# EAGLE design Batboard rev 2.2 (EAGLE 9.1.3)

## Sheet 1 of 7
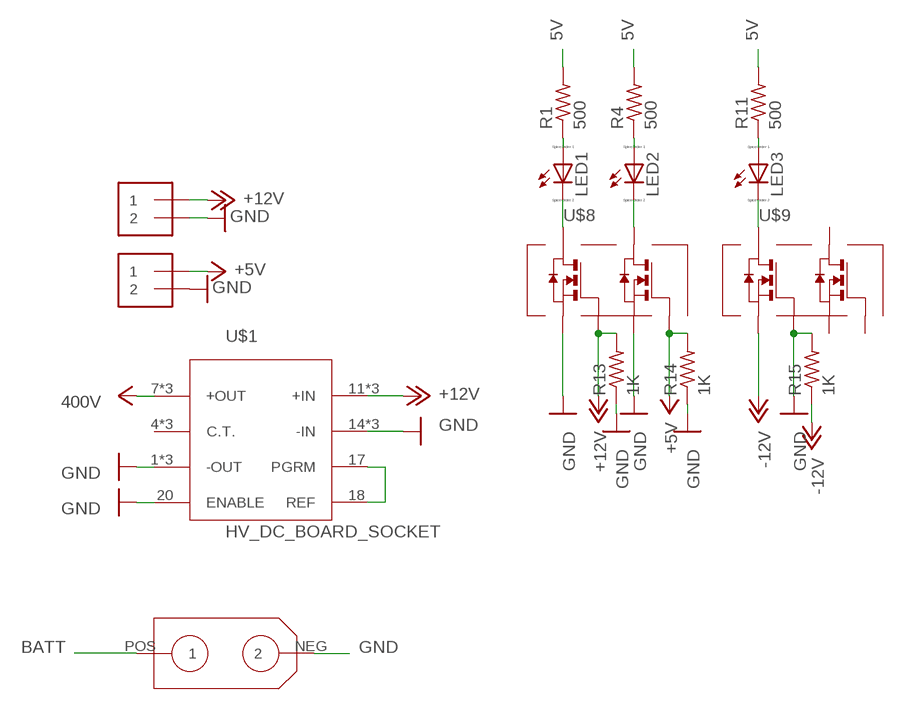
[diagram p0: schematic, sheet 1]

### Parts
J1  1X2-3.5MM  [1X2-3.5MM]
J6  1X2-3.5MM  [1X2-3.5MM]
LED1  LED_E  [LED_1206]
LED2  LED_E  [LED_1206]
LED3  LED_E  [LED_1206]
R1  500  R-US_R1206  [R1206]
R4  500  R-US_R1206  [R1206]
R11  500  R-US_R1206  [R1206]
R13  1K  R-US_R1206  [R1206]
R14  1K  R-US_R1206  [R1206]
R15  1K  R-US_R1206  [R1206]
U$1  HV_DC_BOARD_SOCKET  [HV-DC_BOARD_SOCKET]
U$6  XT60  [XT60]
U$8  DMN2004DMK_DUAL_N-CHANNEL_MOSFET_ARRAY  [SOT23-6]
U$9  DMN2004DMK_DUAL_N-CHANNEL_MOSFET_ARRAY  [SOT23-6]

### Nets
5V: R1.2 R4.2 R11.2
+5V: J6.1 R14.2 U$8.2(G1) ; also sheet 4
+12V: J1.1 R13.2 U$1.11(+IN) U$1.12(+IN) U$1.13(+IN) U$8.5(G) ; also sheet 2,3,5,7
-12V: R15.1 U$9.4(S) ; also sheet 2,5
BATT: U$6.POS ; also sheet 3,4
GND: J1.2 J6.2 R13.1 R14.1 R15.2 U$1.1(-OUT) U$1.2(-OUT) U$1.3(-OUT) U$1.14(-IN) U$1.15(-IN) U$1.16(-IN) U$1.20(ENABLE) U$6.NEG U$8.1(S1) U$8.4(S) U$9.5(G) ; also sheet 2,3,4,5,7
N$1: U$1.17(PGRM) U$1.18(REF)
N$31: LED1.A R1.1
N$84: LED2.A R4.1
N$85: LED3.A R11.1
N$86: LED3.C U$9.6(D)
N$87: LED1.C U$8.6(D)
N$88: LED2.C U$8.3(D1)
V+: U$1.7(+OUT) U$1.8(+OUT) U$1.9(+OUT) ; supply symbol labelled 400V ; also sheet 5
Unconnected: U$1.4(C.T.) U$1.5(C.T.) U$1.6(C.T.) U$9.1(S1) U$9.2(G1) U$9.3(D1)

## Sheet 2 of 7
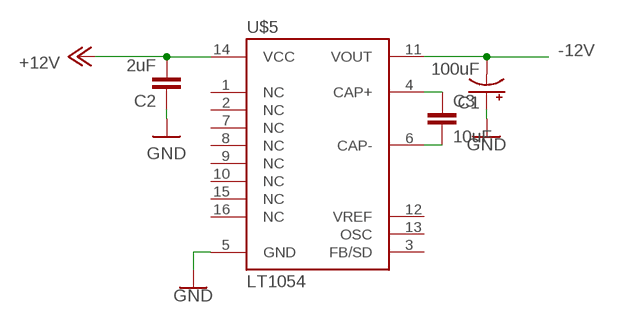
[diagram p1: schematic, sheet 2]

### Parts
C1  100uF  100UF-POLAR-25V-20%(ELEC)  [PANASONIC_D]
C2  2uF  1.0UF-1206-50V-10%  [1206]
C3  10uF  1.0UF-1206-50V-10%  [1206]
U$5  LT1054  [SO16L]

### Nets
+12V: C2.2 U$5.14(VCC) ; also sheet 1,3,5,7
-12V: C1.- U$5.11(VOUT) ; also sheet 1,5
GND: C1.+ C2.1 U$5.5(GND) ; also sheet 1,3,4,5,7
N$46: C3.1 U$5.4(CAP+)
N$47: C3.2 U$5.6(CAP-)
Unconnected: U$5.1(NC) U$5.2(NC) U$5.3(FB/SD) U$5.7(NC) U$5.8(NC) U$5.9(NC) U$5.10(NC) U$5.12(VREF) U$5.13(OSC) U$5.15(NC) U$5.16(NC)

## Sheet 3 of 7
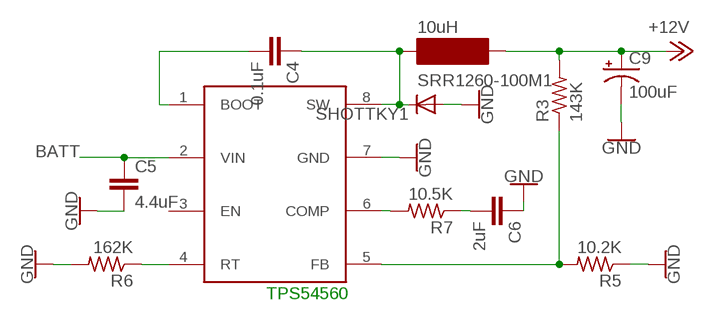
[diagram p2: schematic, sheet 3]

### Parts
C4  0.1uF  1.0UF-1206-50V-10%  [1206]
C5  4.4uF  1.0UF-1206-50V-10%  [1206]
C6  2uF  1.0UF-1206-50V-10%  [1206]
C9  100uF  100UF-POLAR-25V-20%(ELEC)  [PANASONIC_D]
R3  143K  R-US_M1206  [M1206]
R5  10.2K  R-US_M1206  [M1206]
R6  162K  R-US_M1206  [M1206]
R7  10.5K  R-US_M1206  [M1206]
SHOTTKY1  DIODE-DO214AC  [DO214AC]
SRR1260-100M1  10uH  SRR1260-100M  [12.5*12.5]
TPS1  TPS54560  TPS54560(8)  [SOIC127P600X175-8N]

### Nets
+12V: C9.+ R3.2 SRR1260-100M1.P$2 ; also sheet 1,2,5,7
BATT: C5.1 TPS1.2(VIN) ; also sheet 1,4
GND: C5.2 C6.1 C9.- R5.1 R6.2 SHOTTKY1.A TPS1.7(GND) ; also sheet 1,2,4,5,7
N$57: C4.2 TPS1.1(BOOT)
N$58: C4.1 SHOTTKY1.C SRR1260-100M1.P$1 TPS1.8(SW)
N$61: R3.1 R5.2 TPS1.5(FB)
N$62: R6.1 TPS1.4(RT)
N$63: R7.2 TPS1.6(COMP)
N$64: C6.2 R7.1
Unconnected: TPS1.3(EN)

### Notes on the sheet
- TPS54560

## Sheet 4 of 7
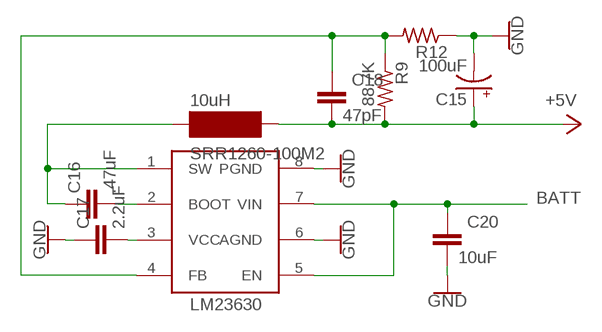
[diagram p3: schematic, sheet 4]

### Parts
C15  100uF  100UF-POLAR-25V-20%(ELEC)  [PANASONIC_D]
C16  .47uF  1.0UF-1206-50V-10%  [1206]
C17  2.2uF  1.0UF-1206-50V-10%  [1206]
C18  47pF  1.0UF-1206-50V-10%  [1206]
C20  10uF  1.0UF-1206-50V-10%  [1206]
R9  88.7K  R-US_M1206  [M1206]
R12  22.1K  R-US_M1206  [M1206]
SRR1260-100M2  10uH  SRR1260-100M  [12.5*12.5]
U$7  LM23630  [SOIC127P602X168-8N]

### Nets
+5V: C15.+ C18.2 R9.2 SRR1260-100M2.P$2 ; also sheet 1
BATT: C20.1 U$7.5(EN) U$7.7(VIN) ; also sheet 1,3
GND: C15.- C17.1 C20.2 R12.1 U$7.6(AGND) U$7.8(PGND) ; also sheet 1,2,3,5,7
N$52: C16.2 U$7.2(BOOT)
N$53: C16.1 SRR1260-100M2.P$1 U$7.1(SW)
N$54: C18.1 R9.1 R12.2 U$7.4(FB)
N$55: C17.2 U$7.3(VCC)

### Notes on the sheet
- LM23630

## Sheet 5 of 7
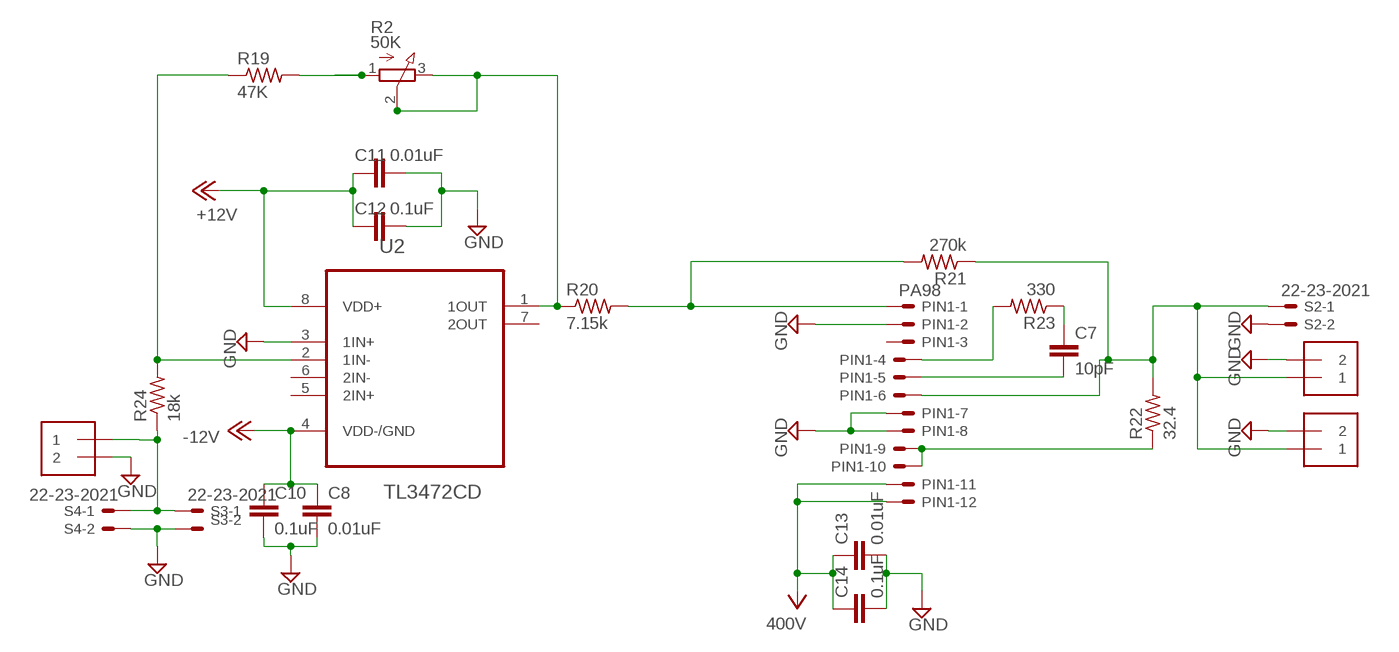
[diagram p4: schematic, sheet 5]

### Parts
C7  10pF  1.0UF-1206-50V-10%  [1206]
C8  0.01uF  1.0UF-1206-50V-10%  [1206]
C10  0.1uF  1.0UF-1206-50V-10%  [1206]
C11  0.01uF  1.0UF-1206-50V-10%  [1206]
C12  0.1uF  1.0UF-1206-50V-10%  [1206]
C13  0.01uF  1.0UF-1206-50V-10%  [1206]
C14  0.1uF  1.0UF-1206-50V-10%  [1206]
J2  1X2-3.5MM  [1X2-3.5MM]
J3  1X2-3.5MM  [1X2-3.5MM]
J5  1X2-3.5MM  [1X2-3.5MM]
PIN1  PA98  22-23-2121  [22-23-2121]
R2  50K  3RP/1610N  [3RP/1610N]
R19  47K  R-US_M1206  [M1206]
R20  7.15k  R-US_M1206  [M1206]
R21  270k  R-US_M1206  [M1206]
R22  32.4  R-US_M1206  [M1206]
R23  330  R-US_M1206  [M1206]
R24  18k  R-US_M1206  [M1206]
S2  22-23-2021  [22-23-2021]
S3  22-23-2021  [22-23-2021]
S4  22-23-2021  [22-23-2021]
U2  TL3472CD  [SOIC127P600X175-8N]

### Nets
+12V: C11.1 C12.1 U2.8(VDD+) ; also sheet 1,2,3,7
-12V: C8.1 C10.1 U2.4(VDD-/GND) ; also sheet 1,2
GND: C8.2 C10.2 C11.2 C12.2 C13.2 C14.2 J2.2 J3.2 J5.2 PIN1.2 PIN1.7 PIN1.8 S2.2 S3.2 S4.2 U2.3(1IN+) ; also sheet 1,2,3,4,7
N$4: J5.1 R24.1 S3.1 S4.1
N$10: R19.1 R24.2 U2.2(1IN-)
N$15: R2.2(S) R2.3(E) R20.1 U2.1(1OUT)
N$17: PIN1.1 R20.2 R21.2
N$20: PIN1.9 PIN1.10 R22.1
N$21: PIN1.4 R23.2
N$22: J2.1 J3.1 PIN1.6 R21.1 R22.2 S2.1
N$24: R2.1(A) R19.2
N$25: C7.2 PIN1.5
N$26: C7.1 R23.1
V+: C13.1 C14.1 PIN1.11 PIN1.12 ; supply symbol labelled 400V ; also sheet 1
Unconnected: PIN1.3 U2.5(2IN+) U2.6(2IN-) U2.7(2OUT)

## Sheet 6 of 7
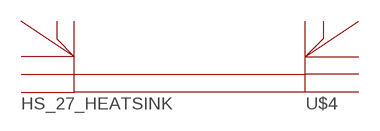
[diagram p5: schematic, sheet 6]

### Parts
U$4  HS_27_HEATSINK  [HS_27_HEATSINK]

## Sheet 7 of 7
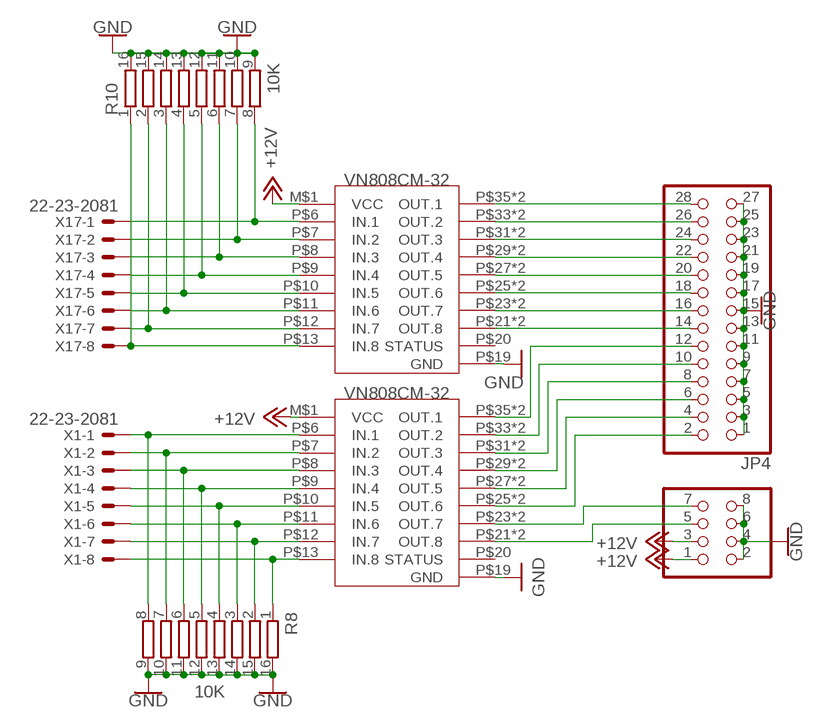
[diagram p6: schematic, sheet 7]

### Parts
JP3  PINHD-2X4  [2X04]
JP4  PINHD-2X14-CB  [2X14-CLEANBIG]
R8  10K  4816P-T01  [4816P]
R10  10K  4816P-T01  [4816P]
U$2  VN808CM-32-E  [PSO36]
U$3  VN808CM-32-E  [PSO36]
X1  22-23-2081  [22-23-2081]
X17  22-23-2081  [22-23-2081]

### Nets
+12V: JP3.1 JP3.3 U$2.M$1(VCC) U$3.M$1(VCC) ; also sheet 1,2,3,5
GND: JP3.2 JP3.4 JP3.6 JP3.8 JP4.1 JP4.3 JP4.5 JP4.7 JP4.9 JP4.11 JP4.13 JP4.15 JP4.17 JP4.19 JP4.21 JP4.23 JP4.25 JP4.27 R8.9 R8.10 R8.11 R8.12 R8.13 R8.14 R8.15 R8.16 R10.9 R10.10 R10.11 R10.12 R10.13 R10.14 R10.15 R10.16 U$2.P$19(GND) U$3.P$19(GND) ; also sheet 1,2,3,4,5
N$2: R10.8 U$2.P$6(IN.1) X17.1
N$3: R10.7 U$2.P$7(IN.2) X17.2
N$5: JP4.28 U$2.P$35(OUT.1) U$2.P$36(OUT.1)
N$6: JP4.26 U$2.P$33(OUT.2) U$2.P$34(OUT.2)
N$7: JP4.24 U$2.P$31(OUT.3) U$2.P$32(OUT.3)
N$8: JP4.22 U$2.P$29(OUT.4) U$2.P$30(OUT.4)
N$9: JP4.20 U$2.P$27(OUT.5) U$2.P$28(OUT.5)
N$11: JP4.18 U$2.P$25(OUT.6) U$2.P$26(OUT.6)
N$12: JP4.16 U$2.P$23(OUT.7) U$2.P$24(OUT.7)
N$13: JP4.14 U$2.P$21(OUT.8) U$2.P$22(OUT.8)
N$14: JP4.12 U$3.P$35(OUT.1) U$3.P$36(OUT.1)
N$16: JP4.10 U$3.P$33(OUT.2) U$3.P$34(OUT.2)
N$18: JP4.8 U$3.P$31(OUT.3) U$3.P$32(OUT.3)
N$19: JP4.6 U$3.P$29(OUT.4) U$3.P$30(OUT.4)
N$23: JP4.4 U$3.P$27(OUT.5) U$3.P$28(OUT.5)
N$27: JP4.2 U$3.P$25(OUT.6) U$3.P$26(OUT.6)
N$28: JP3.7 U$3.P$23(OUT.7) U$3.P$24(OUT.7)
N$29: JP3.5 U$3.P$21(OUT.8) U$3.P$22(OUT.8)
N$30: R8.8 U$3.P$6(IN.1) X1.1
N$32: R10.1 U$2.P$13(IN.8) X17.8
N$33: R10.2 U$2.P$12(IN.7) X17.7
N$35: R10.6 U$2.P$8(IN.3) X17.3
N$36: R10.3 U$2.P$11(IN.6) X17.6
N$37: R10.4 U$2.P$10(IN.5) X17.5
N$38: R10.5 U$2.P$9(IN.4) X17.4
N$39: R8.1 U$3.P$13(IN.8) X1.8
N$40: R8.2 U$3.P$12(IN.7) X1.7
N$41: R8.7 U$3.P$7(IN.2) X1.2
N$42: R8.6 U$3.P$8(IN.3) X1.3
N$43: R8.3 U$3.P$11(IN.6) X1.6
N$44: R8.4 U$3.P$10(IN.5) X1.5
N$45: R8.5 U$3.P$9(IN.4) X1.4
Unconnected: U$2.P$20(STATUS) U$3.P$20(STATUS)

## Library data of the parts
C1 C9 C15 = SparkFun-Capacitors:100UF-POLAR: 100µF polarized capacitors A capacitor is a passive two-terminal electrical component used to store electrical energy temporarily in an electric field.; PROD_ID: CAP-12547
C2-C6 C8 C11 C13 C16-C18 C20 = SparkFun-Capacitors:1.0UF: 1µF ceramic capacitors A capacitor is a passive two-terminal electrical component used to store electrical energy temporarily in an electric field.; MF: KEMET; MPN: C0805C103K1RACTU; OC_FARNELL: 1414661; PROD_ID: CAP-09822; VALUE: 1.0uF
C7 = SparkFun-Capacitors:1.0UF: 1µF ceramic capacitors A capacitor is a passive two-terminal electrical component used to store electrical energy temporarily in an electric field.; MF: KEMET; MPN: C0805C479C5GACTU; OC_FARNELL: 1800809; PROD_ID: CAP-09822; VALUE: 1.0uF
C10 C12 C14 = SparkFun-Capacitors:1.0UF: 1µF ceramic capacitors A capacitor is a passive two-terminal electrical component used to store electrical energy temporarily in an electric field.; MF: KEMET; MPN: C0805C104J5RACTU; OC_FARNELL: 1414663; PROD_ID: CAP-09822; VALUE: 1.0uF
J1-J3 J5 J6 = adafruit:1X2: 3.5mm Terminal block http://www.ladyada.net/library/pcb/eaglelibrary.html
JP3 = adafruit:PINHD-2X4: PIN HEADER
JP4 = adafruit:PINHD-2X14: PIN HEADER
LED1-LED3 = eagle-ltspice:LED_E: LED Source: http://www.osram.convergy.de Source: www.luxeon.com Source: www.kingbright.com; SPICEMODEL: NONE; SPICEPREFIX: D; SPICETYPE: diode
PIN1 = con-molex:22-23-2121: .100" (2.54mm) Center Header - 12 Pin; OC_FARNELL: unknown; OC_NEWARK: 56H0456
R1 R4 R11 R13-R15 = resistor:R-US_: RESISTOR, American symbol
R2 = pot:3RP/1610N: 16mm Potentiometer one level Source: http://www.alphapotentiometers.net/html/16mm_pot_2.html
R3 R5-R7 R9 R12 R24 = adafruit:R-US_: RESISTOR, American symbol; MF: WELWYN; MPN: WCR0805-18KFI; OC_FARNELL: 1100322
R8 R10 = resistor-bourns:4816P-T01: BOURNS RESISTOR NETWORK; MF: BOURNS, INC.; MPN: 4816P-T01-684LF; OC_FARNELL: 9357483; OC_NEWARK: 33K0707
R19 = adafruit:R-US_: RESISTOR, American symbol; MF: KOA SPEAR ELECTRONICS; MPN: SG73S2ATTD9102F; OC_FARNELL: 1400374
R20 = adafruit:R-US_: RESISTOR, American symbol; MF: VISHAY; MPN: CRCW08057K15FKEA; OC_FARNELL: 1152455
R21 = adafruit:R-US_: RESISTOR, American symbol; MF: WELWYN; MPN: WCR0805-270KFI; OC_FARNELL: 1100330RL
R22 R23 = adafruit:R-US_: RESISTOR, American symbol; MF: PANASONIC ELECTRONIC COMPONENTS; MPN: ERJ8ENF32R4V; OC_FARNELL: 2307627
S2-S4 = con-molex:22-23-2021: .100" (2.54mm) Center Header - 2 Pin; MF: MOLEX; MPN: 22-23-2021; OC_FARNELL: 1462926; OC_NEWARK: 25C3832
SHOTTKY1 = diode:DIODE-: DIODE
SRR1260-100M1 SRR1260-100M2 = Inductors:SRR1260-100M
TPS1 = SOIC127P600X175-8N:TPS54560(8)
U2 = TL3472CD:TL3472CD: HIGH-SLEW-RATE, SINGLE-SUPPLY OPERATIONAL AMPLIFIER; AVAILABILITY: Good; DESCRIPTION: High-Slew- ate, Single-Supply Operational Amplifier 8-SOIC 0 to 70; MF: Texas Instruments; MP: TL3472CD; OC_FARNELL: unknown; PACKAGE: SOIC-8 Texas Instruments; PRICE: 0.47 USD
U$1 = ultravolt_daughterboard:HV_DC_BOARD_SOCKET
U$2 U$3 = powersupplybatbot:VN808CM-32-E
U$4 = ultravolt_daughterboard:HS_27_HEATSINK
U$5 = texas-custom:LT1054: The LT1054 is a bipolar, switched-capacitor voltage converter with regulator.
U$6 = ultravolt_daughterboard:XT60
U$7 = SOIC127P602X168-8N:LM23630: LM23630 5V 3A
U$8 U$9 = ultravolt_daughterboard:DMN2004DMK_DUAL_N-CHANNEL_MOSFET_ARRAY
X1 X17 = con-molex:22-23-2081: .100" (2.54mm) Center Header - 8 Pin; MF: MOLEX; MPN: 22-23-2081; OC_FARNELL: 1756826; OC_NEWARK: 01C7592

## Board
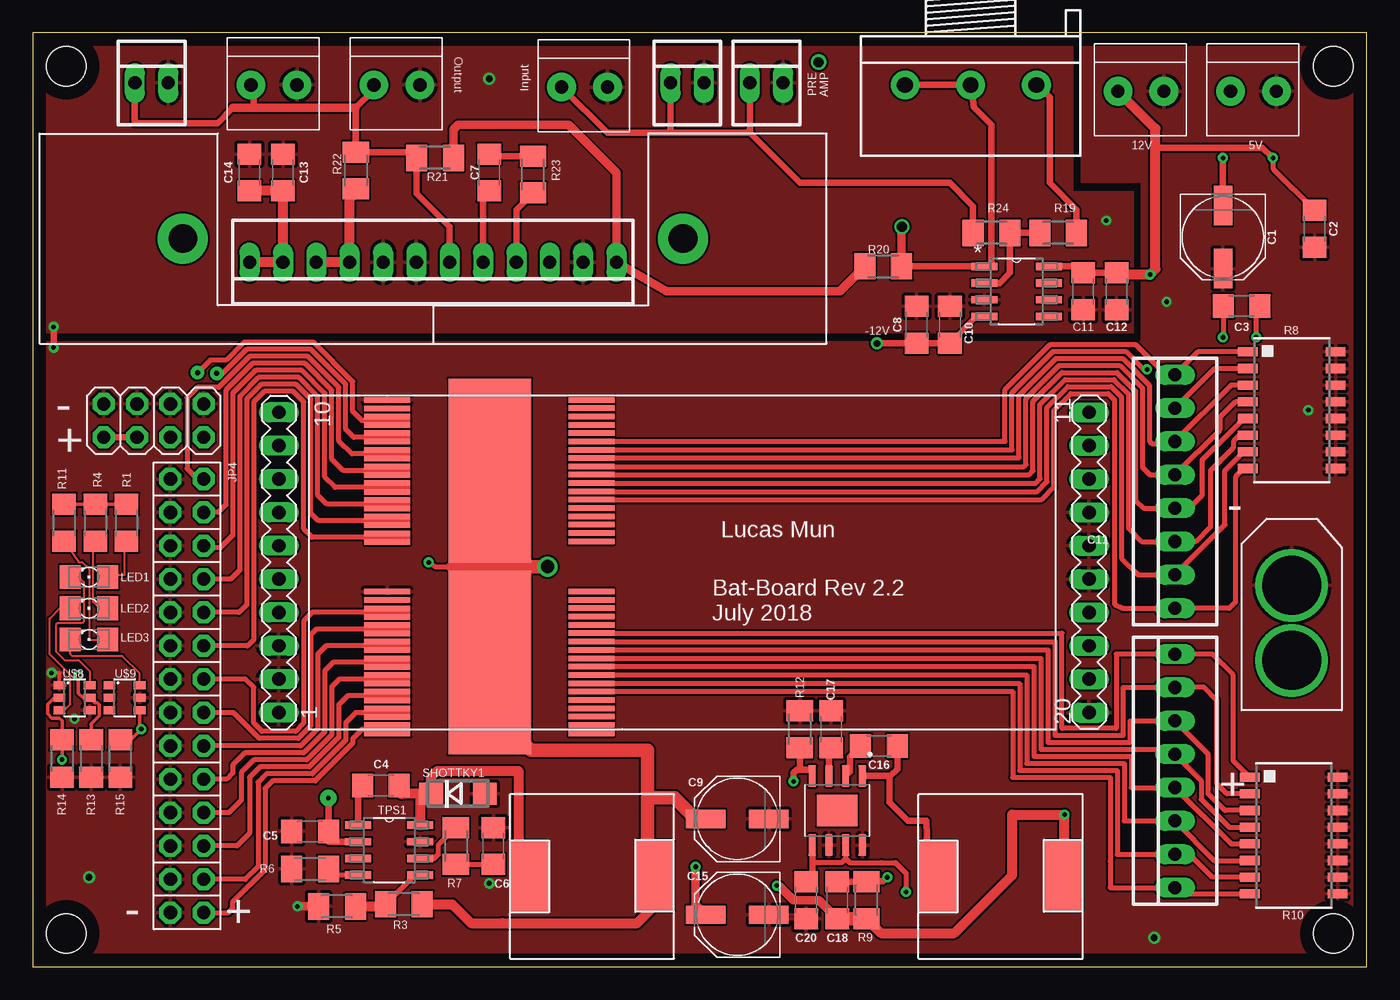
[diagram p7: board, top side]
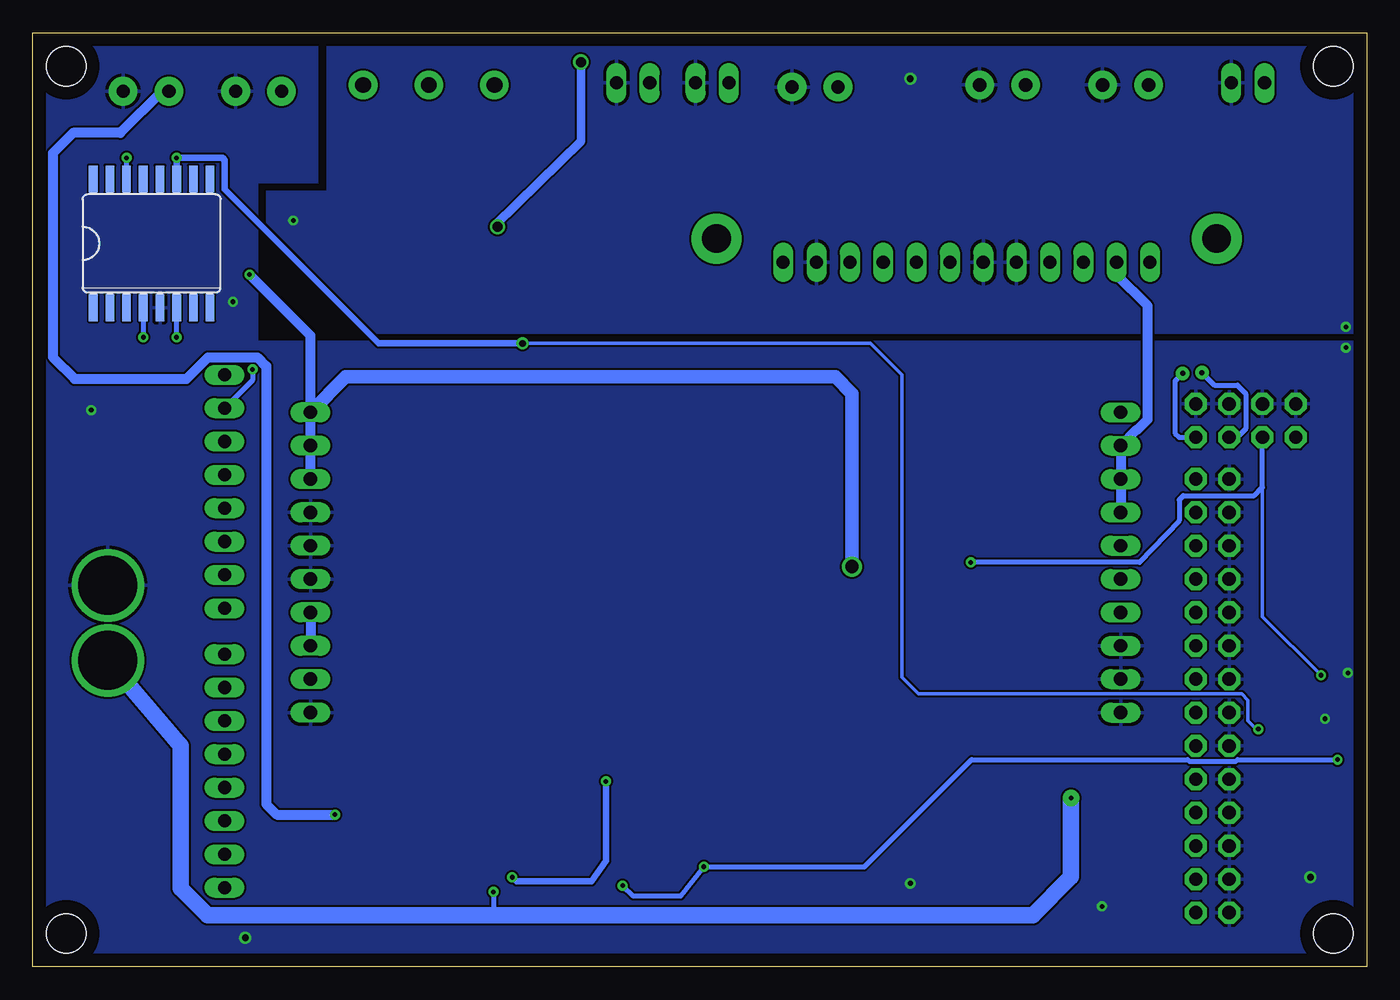
[diagram p8: board, bottom side, seen from below]

Size 101.6 x 71.12 mm. Coordinates in mm from the lower left corner, seen from the top.
Outline: 101.6,0 101.6,71.12 0,71.12 0,0 101.6,0
Copper layers (1*16): Top 0.035mm / dielectric 1.5mm / Bottom 0.035mm
Design rules "default": minimum track width 6mil, minimum drill 0.35mm, track to track 6mil, track to pad 6mil, pad to pad 6mil, via to via 6mil, smd to smd 6mil, copper to edge 40mil, drill to drill 6mil, minimum pad ring 10mil, minimum via ring 8mil, stop-mask expansion 4mil, vias tented up to drill 0mil, thermal gap 10mil
Holes 3 mm at 2.54,68.58 2.54,2.54 99.06,2.54 99.06,68.58

### Footprints (pad centres in the part's own frame; a part is rotated, then mirrored left to right if it is on the bottom)
PANASONIC_D = smd 3 x 1.4: + 2.4,0; - -2.4,0
1206 = smd 1.6 x 1.8: 1 -1.4,0; 2 1.4,0
1X2-3.5MM = drill 1 pad 2.184: 1 1.8,0; 2 -1.7,0
2X04 = drill 1.016 pad 1.676 octagon: 1 -3.81,-1.27; 2 -3.81,1.27; 3 -1.27,-1.27; 4 -1.27,1.27; 5 1.27,-1.27; 6 1.27,1.27; 7 3.81,-1.27; 8 3.81,1.27
2X14-CLEANBIG = drill 1.016 pad 1.676 octagon: 1 -16.51,-1.27; 2 -16.51,1.27; 3 -13.97,-1.27; 4 -13.97,1.27; 5 -11.43,-1.27; 6 -11.43,1.27; 7 -8.89,-1.27; 8 -8.89,1.27; 9 -6.35,-1.27; 10 -6.35,1.27; 11 -3.81,-1.27; 12 -3.81,1.27; 13 -1.27,-1.27; 14 -1.27,1.27; 15 1.27,-1.27; 16 1.27,1.27; 17 3.81,-1.27; 18 3.81,1.27; 19 6.35,-1.27; 20 6.35,1.27; 21 8.89,-1.27; 22 8.89,1.27; 23 11.43,-1.27; 24 11.43,1.27; 25 13.97,-1.27; 26 13.97,1.27; 27 16.51,-1.27; 28 16.51,1.27
LED_1206 = smd 1.6 x 1.803: A -1.422,0; C 1.422,0
22-23-2121 = drill 1 long: 1 -13.97,0; 2 -11.43,0; 3 -8.89,0; 4 -6.35,0; 5 -3.81,0; 6 -1.27,0; 7 1.27,0; 8 3.81,0; 9 6.35,0; 10 8.89,0; 11 11.43,0; 12 13.97,0
R1206 = smd 1.6 x 1.803: 1 -1.422,0; 2 1.422,0
3RP/1610N = drill 1.2 pad 2.184: 1 -5,0; 2 0,0; 3 5,0
M1206 = smd 1.6 x 2: 1 -1.4,0; 2 1.4,0
4816P = smd 0.7 x 1.5: 1 -4.445,-3.346; 2 -3.175,-3.346; 3 -1.905,-3.346; 4 -0.635,-3.346; 5 0.635,-3.346; 6 1.905,-3.346; 7 3.175,-3.346; 8 4.445,-3.346; 9 4.445,3.346; 10 3.175,3.346; 11 1.905,3.346; 12 0.635,3.346; 13 -0.635,3.346; 14 -1.905,3.346; 15 -3.175,3.346; 16 -4.445,3.346
22-23-2021 = drill 1 long: 1 -1.27,0; 2 1.27,0
DO214AC = smd 1.8 x 1.7: A 2.05,0; C -2.05,0
12.5*12.5 = smd 2.9 x 5.4: P$1 -4.9,-0.1; P$2 4.7,-0.05
SOIC127P600X175-8N = smd 1.981 x 0.559: 1 -2.362,1.905; 2 -2.362,0.635; 3 -2.362,-0.635; 4 -2.362,-1.905; 5 2.362,-1.905; 6 2.362,-0.635; 7 2.362,0.635; 8 2.362,1.905
SOIC127P600X175-8N' = smd 1.981 x 0.559: 1 -2.464,1.905; 2 -2.464,0.635; 3 -2.464,-0.635; 4 -2.464,-1.905; 5 2.464,-1.905; 6 2.464,-0.635; 7 2.464,0.635; 8 2.464,1.905
HV-DC_BOARD_SOCKET = drill 1.016 long: 1 -11.43,-13.97; 2 -11.43,-11.43; 3 -11.43,-8.89; 4 -11.43,-6.35; 5 -11.43,-3.81; 6 -11.43,-1.27; 7 -11.43,1.27; 8 -11.43,3.81; 9 -11.43,6.35; 10 -11.43,8.89; 11 50.292,8.89; 12 50.292,6.35; 13 50.292,3.81; 14 50.292,1.27; 15 50.292,-1.27; 16 50.292,-3.81; 17 50.292,-6.35; 18 50.292,-8.89; 19 50.292,-11.43; 20 50.292,-13.97
PSO36 = smd 14 x 6.3: M$1 0.317,0.117 | smd 0.42 x 3.5: P$1 -5.08,-7.618; P$2 -4.43,-7.618; P$3 -3.796,-7.618; P$4 -3.176,-7.618; P$5 -2.526,-7.618; P$6 -1.892,-7.618; P$7 -1.272,-7.618; P$8 -0.622,-7.618; P$9 0.012,-7.618; P$10 0.632,-7.618; P$11 1.282,-7.618; P$12 1.902,-7.618; P$13 2.552,-7.618; P$14 3.186,-7.618; P$15 3.806,-7.618; P$16 4.456,-7.618; P$17 5.09,-7.618; P$18 5.71,-7.618; P$19 5.71,7.931; P$20 5.06,7.931; P$21 4.44,7.931; P$22 3.79,7.931; P$23 3.17,7.931; P$24 2.52,7.931; P$25 1.9,7.931; P$26 1.25,7.931; P$27 0.63,7.931; P$28 -0.02,7.931; P$29 -0.64,7.931; P$30 -1.29,7.931; P$31 -1.91,7.931; P$32 -2.56,7.931; P$33 -3.178,7.931; P$34 -3.828,7.931; P$35 -4.462,7.931; P$36 -5.096,7.931
HS_27_HEATSINK = drill 2.184 pad 3.81: 1 -19.05,6.553; 2 19.05,6.553
SO16L = smd 0.66 x 2.032: 1 -4.445,-4.902; 2 -3.175,-4.902; 3 -1.905,-4.902; 4 -0.635,-4.902; 5 0.635,-4.902; 6 1.905,-4.902; 7 3.175,-4.902; 8 4.445,-4.902; 9 4.445,4.902; 10 3.175,4.902; 11 1.905,4.902; 12 0.635,4.902; 13 -0.635,4.902; 14 -1.905,4.902; 15 -3.175,4.902; 16 -4.445,4.902
XT60 = drill 4.5: NEG 2.857,0; POS -2.857,0
SOIC127P602X168-8N = smd 1.65 x 0.59: 1 -2.635,1.905; 2 -2.635,0.635; 3 -2.635,-0.635; 4 -2.635,-1.905; 5 2.635,-1.905; 6 2.635,-0.635; 7 2.635,0.635; 8 2.635,1.905 | smd 2.41 x 3.1: 9 0,0
SOT23-6 = smd 0.6 x 0.9: 1 -0.95,-1.15; 2 0,-1.15; 3 0.95,-1.15; 4 0.95,1.15; 5 0,1.15; 6 -0.95,1.15
22-23-2081 = drill 1 long: 1 -8.89,0; 2 -6.35,0; 3 -3.81,0; 4 -1.27,0; 5 1.27,0; 6 3.81,0; 7 6.35,0; 8 8.89,0

### Placement (x,y rotation side)
C1  90.65,55.56 270 top
C2  97.63,56.2 90 top
C3  92.08,50.32 180 top
C4  26.51,13.81 180 top
C5  21.11,10.32 180 top
C6  35.08,9.21 270 top
C7  34.77,60.48 270 top
C8  67.31,48.9 90 top
C9  53.66,11.27 180 top
C10  69.85,48.9 90 top
C11  80.01,51.44 270 top
C12  82.55,51.44 270 top
C13  19.05,60.48 90 top
C14  16.51,60.48 90 top
C15  53.66,3.97 180 top
C16  64.45,16.83 180 top
C17  60.8,18.1 270 top
C18  61.28,5.08 270 top
C20  58.9,5.08 270 top
J1  84.45,66.67 180 top
J2  27.78,67.15 180 top
J3  18.41,67.15 180 top
J5  42.07,66.99 180 top
J6  93.03,66.67 180 top
JP3  9.21,41.59 0 top
JP4  11.75,20.64 270 top
LED1  4.29,29.69 180 top
LED2  4.29,27.3 180 top
LED3  4.29,24.92 180 top
PIN1  30.48,53.66 180 top
R1  7.14,33.81 90 top
R2  71.44,67.15 180 top
R3  28.26,4.76 0 top
R4  4.76,33.81 90 top
R5  23.18,4.6 0 top
R6  21.11,7.46 180 top
R7  32.23,9.21 90 top
R8  95.89,42.39 270 top
R9  63.5,5.08 270 top
R10  96.04,10 270 top
R11  2.38,33.81 90 top
R12  58.42,18.1 270 top
R13  4.45,15.88 90 top
R14  2.22,15.88 90 top
R15  6.67,15.88 270 top
R19  78.11,55.88 0 top
R20  64.77,53.34 180 top
R21  30.64,61.59 0 top
R22  24.61,60.64 90 top
R23  38.1,60.33 270 top
R24  73.03,55.88 0 top
S2  9.05,67.31 0 top
S3  49.85,67.31 0 top
S4  55.88,67.31 0 top
SHOTTKY1  32.38,13.18 0 top
SRR1260-100M1  42.7,6.99 0 top
SRR1260-100M2  73.82,6.99 0 top
TPS1  27.15,8.89 0 top
U2  TL3472CD  [SOIC127P600X175-8N']  74.93,51.44 0 top
U$1  30.16,33.34 0 top
U$2  34.92,22.86 90 top
U$3  34.92,37.47 90 top
U$4  30.48,48.9 0 top
U$5  92.55,55.09 0 bottom
U$6  95.89,26.19 90 top
U$7  61.28,11.91 270 top
U$8  3.17,20.48 270 top
U$9  6.99,20.48 270 top
X1  87,36.2 90 top
X17  87,14.92 90 top

### Tracks (layer width: path | path; a pad name or v marks a point on that pad's centre or on a via)
5V
  Top 0.254: R11.2 R4.2 R1.2
+5V  (via drill 0.35)
  Top 0.254: U$8.2 1.62,20.48 1.14,20 1.14,19.27 1.46,18.95 2.01,18.95 2.22,18.73 R14.2 v2.22,15.78
  Top 0.635: v50.48,7.62 50.48,4.74 C15.+ | C18.2 59.88,5.08 57.93,5.08 56.82,6.19 v56.67,6.19
  Top 0.762: SRR1260-100M2.P$2 78.52,11.52 v78.59,11.59 74.61,11.59 74.61,6.99 70.2,2.57 64.61,2.57 R9.2
  Top 1.016: C18.2 R9.2
  Bottom 0.381: v2.22,15.78 9.85,15.78 9.99,15.65 13.51,15.65 13.64,15.78 30.09,15.78 38.26,7.62 v50.48,7.62 52.23,5.4 55.88,5.4 v56.67,6.19
  Bottom 0.762: J6.1 91.76,66.67 94.93,63.5 98.53,63.5 100.08,61.95 100.08,46.42 98.42,44.77 89.89,44.77 88.25,46.41 84.49,46.41 83.82,45.74 83.82,12.38 83.03,11.59 v78.59,11.59
+12V  (via drill 0.35, 0.35 pad 0.08, 1.02)
  Top 0.254: R13.2 4.45,18.5 5.05,19.11 5.05,19.94 4.89,20.11 4.7,20.11 U$8.5 3.85,20.48 3.48,20.85 v3.48,22.21
  Top 0.381: v30.16,30.8 30.64,30.48 31.75,30.48 | v94.46,61.59 94.46,60.77 C2.2
  Top 0.508: U2.8 79.5,53.34 C11.1 C12.1 | JP3.3 JP3.1 | 85.51,62.39 93.66,62.39 v94.46,61.59 | 34.97,25.72 34.81,25.56 U$2.M$1 36.67,21.31
  Top 0.635: 31.75,30.48 34.81,30.48
  Top 0.762: C12.1 82.68,52.7 v85.09,52.7 85.51,53.13 85.51,62.39 85.51,63.82 J1.1 | 34.81,30.48 37.62,30.48 | R3.2 31.94,4.76 33.37,3.33 35.76,3.33 46.04,3.33 47.31,4.6 47.31,6.84 SRR1260-100M1.P$2 | 47.47,12.86 46.83,12.86 46.83,13.34
  Top 1.016: 37.62,30.48 v39.21,30.48 | 36.67,21.31 36.67,18.41 37.15,17.94 37.15,17.62 36.99,17.46 37.94,16.51 46.83,16.51 46.83,13.34 | C9.+ 50.48,11.27 48.9,12.86 47.47,12.86 | SRR1260-100M1.P$2 46.83,7.51 46.83,12.86
  Top 1.27: 34.92,23.06 U$2.M$1
  Top 1.778: 34.61,23.18 U$2.M$1
  Top 2.54: U$3.M$1 34.81,30.48 34.97,25.72
  Bottom 0.254: v3.48,22.21 7.94,26.67 JP3.3
  Bottom 0.381: JP3.3 7.94,36.51 8.57,35.88 13.97,35.88 14.29,35.56 14.29,33.97 17.3,30.8 v30.16,30.8 | U$5.14 v94.46,61.59
  Bottom 0.762: v85.09,52.7 80.45,48.07 U$1.11 U$1.12 U$1.13
  Bottom 1.016: v39.21,30.48 39.21,43.66 40.48,44.93 77.76,44.93 U$1.11
-12V  (via drill 0.35, 0.35 pad 0.08, 0.51)
  Top 0.254: U$9.4 8.13,18.22 v8.26,18.1 7.46,17.3 R15.1
  Top 0.381: C10.1 71.89,49.53 U2.4 | 90.65,58.26 90.65,58.12
  Top 0.508: C10.1 C8.1 64.32,47.49 v64.29,47.47 | 90.65,58.12 90.65,58.26 | 90.65,58.26 v90.65,61.59 | C1.- 90.65,58.26
  Bottom 0.254: v64.29,47.47 37.78,47.47 35.4,45.09 35.4,22.07 34.12,20.79 10.02,20.79 10.01,20.8 9.53,20.8 9.05,20.32 9.05,18.73 8.41,18.1 v8.26,18.1
  Bottom 0.508: v64.29,47.47 75.25,47.47 87,59.21 87,61.44 87.15,61.59 v90.65,61.59 U$5.11
BATT  (via drill 0.35, 0.35 pad 1.27)
  Top 0.381: U$7.7 61.91,8.26 | 61.91,8.26 61.6,7.94 60.23,7.94 59.37,7.94 | 61.91,8.26 62.23,7.94 64.64,7.94 65.72,7.94 66.52,7.14 v66.52,5.71
  Top 0.508: v22.51,12.86 C5.1 22.51,9.53 TPS1.2 | C20.1 59.37,6.96 59.37,7.94 U$7.5
  Bottom 0.381: v66.52,5.71 66.52,3.94
  Bottom 0.508: 72.83,3.97 72.87,3.94
  Bottom 1.27: U$6.POS 90.33,16.83 90.33,6 88.27,3.94 72.87,3.94 66.52,3.94 33.95,3.94 33.94,3.94 25.43,3.94 22.51,6.86 v22.51,12.86
GND  (via drill 0.35, 0.35 pad 0.51, 0.38, 0.51)
  Top 0.254: U$8.1 2.02,22.34 2.06,22.38 v1.43,22.38
  Top 0.508: v1.59,48.74 v1.59,47.15
  Top 0.635: v20.16,4.6 R5.1
  other vias: 97.16,42.39 34.77,6.35 3.17,18.89 86.36,50.64 81.76,56.83 34.77,67.63 85.41,2.22 4.29,6.83
  pour Bottom: -0.32,71.44 79.22,71.44 79.22,59.05 83.82,59.05 83.82,48.26 -0.32,48.26
  pour Top: -0.32,71.44 79.22,71.44 79.22,59.05 83.82,59.05 83.82,48.26 -0.32,48.26
  pour Top: -0.32,47.62 84.45,47.62 84.45,59.53 84.45,59.69 79.85,59.69 79.85,71.75 102.08,71.75 102.08,-0.79 92.71,-0.79 -0.32,-0.79
  pour Bottom: -0.32,47.62 84.45,47.62 84.45,59.69 79.85,59.69 79.85,71.75 102.08,71.75 102.08,-0.79 -0.32,-0.79
N$1
  Bottom 0.762: U$1.17 U$1.18
N$2
  Top 0.381: U$2.P$6 74.65,20.97 74.65,14.43 82.06,14.43 82.06,8.04 82.07,8.04 82.07,6.03 X17.1 87.47,5.56 R10.8
N$3
  Top 0.381: U$2.P$7 75.18,21.59 75.18,14.96 82.59,14.96 82.59,8.57 X17.2 87.79,8.57 87.95,8.73 89.85,6.83 R10.7
N$4
  Top 0.508: S3.1 48.58,63.5 | S4.1 54.61,63.5 | R24.1 71.62,57.91 69.85,59.69 58.42,59.69 54.61,63.5 | 48.58,63.5 48.9,63.5 54.61,63.5 | J5.1 43.76,63.5 48.58,63.5
N$5
  Top 0.254: U$2.P$35 26.99,18.1 U$2.P$36
  Top 0.381: JP4.28 14.92,4.13 15.24,4.45 15.24,4.96 17.68,7.4 17.68,13.58 18.26,14.16 21.5,14.16 24.37,17.03 24.37,17.39 25.08,18.1 26.99,18.1 28.57,18.1
N$6
  Top 0.254: U$2.P$34 26.99,19.37 U$2.P$33
  Top 0.381: 26.67,19.37 24.61,19.37 23.84,18.6 23.84,17.25 21.28,14.69 17.78,14.69 17.14,14.06 17.14,7.62 16.19,6.67 JP4.26 | 26.99,19.37 28.57,19.37
  Top 0.508: 26.99,19.37 26.67,19.37
N$7
  Top 0.254: U$2.P$32 26.99,20.64 U$2.P$31
  Top 0.381: JP4.24 15.56,9.21 16.51,10.16 16.51,14.43 17.3,15.23 21.06,15.23 23.3,17.47 23.3,19.97 23.97,20.64 26.99,20.64 28.57,20.64
N$8
  Top 0.254: U$2.P$30 26.99,21.91 U$2.P$29
  Top 0.381: 26.67,21.91 23.34,21.91 22.77,21.34 22.77,17.69 20.84,15.76 16.83,15.76 15.88,14.81 15.88,12.7 14.92,11.75 JP4.22 | 26.99,21.91 28.57,21.91
  Top 0.508: 26.99,21.91 26.67,21.91
N$9
  Top 0.254: U$2.P$28 26.99,23.18 U$2.P$27
  Top 0.381: JP4.20 14.76,14.29 15.24,14.76 15.24,15.39 16.15,16.29 20.62,16.29 22.24,17.91 22.24,22.54 22.87,23.18 26.99,23.18 28.57,23.18
N$10
  Top 0.508: R19.1 R24.2 74.42,52.84 73.66,52.07 U2.2
N$11
  Top 0.254: U$2.P$26 26.99,24.45 U$2.P$25
  Top 0.381: JP4.18 20.4,16.83 21.7,18.13 21.7,23.81 22.34,24.45 26.99,24.45 28.57,24.45
N$12
  Top 0.254: U$2.P$24 26.99,25.72 U$2.P$23
  Top 0.381: JP4.16 15.28,19.37 17.24,17.41 20.22,17.41 21.17,18.35 21.17,25.3 21.59,25.72 26.99,25.72 28.57,25.72
N$13
  Top 0.254: U$2.P$22 26.99,26.99 U$2.P$21
  Top 0.381: JP4.14 16.19,21.91 16.83,21.27 16.83,18.57 17.46,17.94 20,17.94 20.64,18.57 20.64,26.35 21.27,26.99 26.99,26.99 28.57,26.99
N$14
  Top 0.254: U$3.P$36 26.99,32.7 U$3.P$35
  Top 0.381: JP4.12 16.35,24.45 16.83,24.92 16.83,43.02 17.62,43.81 19.84,43.81 20.64,43.02 20.64,33.34 21.27,32.7 26.99,32.7 28.57,32.7
N$15  (via drill 0.76)
  Top 0.508: R20.1 U2.1 73.03,53.34 73.03,64.14 71.7,65.46 R2.2 R2.3
  Top 0.635: v66.2,56.36 66.17,56.17 R20.1
  Bottom 0.635: v59.85,68.9 59.85,62.87 66.36,56.52 v66.2,56.36
N$16
  Top 0.254: U$3.P$34 26.99,33.97 U$3.P$33
  Top 0.381: JP4.10 15.72,26.99 16.29,27.57 16.29,43.24 17.4,44.35 20.07,44.35 21.17,43.24 21.17,34.55 21.75,33.97 26.99,33.97 28.57,33.97
N$17
  Top 0.635: R20.2 61.47,51.44 48.26,51.44 PIN1.1 44.45,60.48 40.8,64.14 32.38,64.14 32.04,63.79 R21.2
N$18
  Top 0.254: U$3.P$32 26.99,35.24 U$3.P$31
  Top 0.381: JP4.8 15.08,29.53 15.76,30.21 15.76,43.46 17.18,44.88 20.29,44.88 21.7,43.46 21.7,35.92 22.38,35.24 26.99,35.24 28.57,35.24
N$19
  Top 0.254: U$3.P$30 26.99,36.51 U$3.P$29
  Top 0.381: JP4.6 13.18,31.91 14.29,31.91 15.23,32.85 15.23,43.68 16.96,45.41 20.51,45.41 22.24,43.68 22.24,37.29 23.02,36.51 26.99,36.51 28.57,36.51
N$20
  Top 0.508: 24.13,58.29 24.61,58.77 R22.1
  Top 0.762: 24.13,58.29 PIN1.9 PIN1.10
N$21
  Top 0.508: R23.2 36.83,57.66 PIN1.4
N$22
  Top 0.508: PIN1.6 31.75,56.36 29.24,58.87 R21.1 28.79,62.04 R22.2 24.61,65.41 | J3.1 16.83,66.94 16.83,65.41 | 24.61,65.41 15.24,65.41 14.07,64.24 7.78,64.24 7.78,64.72 S2.1 | 24.61,65.41 25.98,66.78 J2.1
  Top 0.635: 15.24,65.41 16.83,65.41 24.61,65.41
N$23
  Top 0.254: U$3.P$28 26.99,37.78 U$3.P$27
  Top 0.381: JP4.4 14.13,34.61 14.69,35.17 14.69,43.91 16.74,45.95 20.73,45.95 22.77,43.91 22.77,38.66 23.65,37.78 26.99,37.78 28.57,37.78
N$24
  Top 0.508: R2.1 77.47,66.23 77.47,59.69 79.5,57.66 R19.2
N$25
  Top 0.508: PIN1.5 34.29,58.61
  Top 0.635: 34.29,58.61 C7.2
N$26
  Top 0.508: R23.1 34.92,61.73 C7.1
N$27
  Top 0.254: U$3.P$26 26.99,39.05 U$3.P$25
  Top 0.381: JP4.2 12.54,37.15 11.75,37.94 11.75,43.34 12.54,44.13 14.17,44.13 16.52,46.48 20.95,46.48 23.3,44.13 23.3,40.04 24.29,39.05 26.99,39.05 28.57,39.05
N$28  (via drill 0.38 pad 1.02)
  Top 0.254: U$3.P$24 26.99,40.32 U$3.P$23
  Top 0.381: v14.02,45.19 14.47,45.19 16.3,47.02 21.17,47.02 23.84,44.35 23.84,40.93 24.45,40.32 26.99,40.32 28.57,40.32
  Bottom 0.381: JP3.7 14.29,40.32 14.61,40.64 14.61,44.61 v14.02,45.19
N$29  (via drill 0.38 pad 1.02)
  Top 0.254: U$3.P$22 26.99,41.59 U$3.P$21
  Top 0.381: v12.54,45.24 13.49,46.2 14.72,46.2 16.07,47.55 21.39,47.55 24.37,44.57 24.37,42.3 25.08,41.59 26.99,41.59 28.57,41.59
  Bottom 0.381: v12.54,45.24 11.59,44.29 9.84,44.29 9.21,43.66 9.21,40.96 9.84,40.32 JP3.5
N$30
  Top 0.381: U$3.P$6 76.85,35.57 77.79,36.51 77.79,42.39 79.06,43.66 81.92,43.66 82.39,43.18 82.39,27.62 83.03,27.3 X1.1 91.12,27.3 91.6,27.78 91.6,37.32 92.22,37.94 R8.8
N$31
  Top 0.152: R1.1 7.09,32.2 6.99,32.09 6.99,29.84 5.87,29.84 LED1.A
N$32
  Top 0.381: U$2.P$13 78.38,25.41 78.38,18.16 82.53,18.16 82.53,23.81 X17.8 89.85,23.81 91.44,22.23 91.44,15.7 R10.1
N$33
  Top 0.381: U$2.P$12 77.85,24.76 77.85,17.63 83.06,17.63 83.06,21.27 X17.7 89.22,21.27 90.17,20.32 90.17,13.96 90.95,13.18 R10.2
N$35
  Top 0.381: U$2.P$8 75.72,22.24 75.72,15.49 83.13,15.49 83.13,11.11 X17.3 90.01,8.1 R10.6
N$36
  Top 0.381: U$2.P$11 77.32,24.14 77.32,17.09 83.59,17.09 83.59,18.73 X17.6 89.53,16.19 89.53,13.18 90.81,11.91 R10.3
N$37
  Top 0.381: U$2.P$10 76.78,23.49 76.78,16.56 87,16.56 X17.5 89,14.19 89,12.76 91.12,10.64 R10.4
N$38
  Top 0.381: U$2.P$9 76.25,22.87 76.25,16.03 79.38,16.03 83.66,16.03 83.66,13.65 X17.4 91.28,9.37 R10.5
N$39
  Top 0.381: U$3.P$13 74.05,40.02 74.05,43.93 77.51,47.39 83.99,47.39 86.3,45.09 X1.8 88.74,46.83 R8.1
N$40  (via drill 0.35)
  Top 0.381: U$3.P$12 74.59,39.37 74.59,43.71 77.73,46.86 83.24,46.86 84.6,45.5 v84.87,45.5 | R8.2 90.01,45.56 X1.7
  Bottom 0.381: v84.87,45.5 84.87,44.67 X1.7
N$41
  Top 0.381: U$3.P$7 76.52,36.19 77.25,36.93 77.25,42.61 78.84,44.19 82.14,44.19 82.92,43.4 82.92,31.11 84.19,29.84 X1.2 90.81,33.66 90.81,37.79 92.22,39.21 R8.7
N$42
  Top 0.381: U$3.P$8 76.41,36.84 76.72,37.15 76.72,42.83 78.62,44.72 82.36,44.72 83.46,43.62 83.46,33.38 84.45,32.38 X1.3 88.58,32.38 89.69,33.5 89.69,37.78 91.45,39.53 91.45,40.02 91.91,40.48 R8.6
N$43
  Top 0.381: U$3.P$11 75.1,38.75 75.12,38.77 75.12,43.49 77.95,46.32 83.02,46.32 85.06,44.28 85.06,40.04 85.25,39.85 86.84,39.85 X1.6 91.28,44.29 R8.3
N$44
  Top 0.381: U$3.P$10 75.49,38.1 75.65,38.26 75.65,43.27 78.17,45.79 82.8,45.79 84.53,44.06 84.53,38.03 85.09,37.47 X1.5 90.41,40.88 90.41,41.83 91.6,43.02 R8.4
N$45
  Top 0.381: U$3.P$9 75.89,37.48 76.19,37.77 76.19,43.05 78.39,45.26 82.58,45.26 83.99,43.84 83.99,35.55 84.61,34.92 X1.4 88.11,34.92 89.06,35.88 89.06,38.58 91.04,40.56 91.04,40.57 92.22,41.75 R8.5
N$46  (via drill 0.35 pad 0.08)
  Top 0.381: v93.19,47.94 93.19,50.03 C3.1
  Bottom 0.381: U$5.4 v93.19,47.94
N$47  (via drill 0.35 pad 0.08)
  Top 0.381: C3.2 90.67,47.97 v90.65,47.94
  Bottom 0.381: v90.65,47.94 U$5.6
N$52
  Top 0.508: C16.2 62.23,16 62.23,14.86 U$7.2
N$53
  Top 0.508: C16.1 65.85,15.05 65.34,14.54 | 65.34,14.54 U$7.1 | 65.34,14.54 65.25,14.45 65.25,12.54 66.67,11.11 68.07,11.11 68.17,7.64 SRR1260-100M2.P$1
N$54  (via drill 0.35)
  Top 0.508: C18.1 R9.1 63.53,6.51 64.77,6.51 v65.09,6.83 | R12.2 58.42,15.34 58.42,15.02 58.83,15.02 | 58.83,15.02 59.37,15.02 U$7.4 | 58.83,15.02 58.2,15.02 57.94,14.76 v57.94,14.13
  Bottom 0.508: v57.94,14.13 57.94,8.1 59.05,6.51 64.77,6.51 v65.09,6.83
N$55
  Top 0.508: C17.2 60.8,16.51 60.64,16.35 U$7.3
N$57
  Top 0.508: C4.2 24.78,13.48 TPS1.1
N$58
  Top 0.762: SHOTTKY1.C 28.07,13.18 C4.1 | SHOTTKY1.C 29.51,13.18 TPS1.8 | SHOTTKY1.C 30.34,14.46 30.8,14.92 36.99,14.92 36.99,7.7 SRR1260-100M1.P$1
N$61
  Top 0.381: R3.1 29.08,6.99 TPS1.5
  Top 0.762: R5.2 26.7,4.6 R3.1
N$62
  Top 0.381: TPS1.4 22.99,6.99 R6.1
N$63
  Top 0.381: R7.2 30.88,9.27 30.88,8.57 30.57,8.26 TPS1.6
N$64
  Top 0.381: R7.1 C6.2
N$84
  Top 0.152: R4.1 4.6,32.39 4.59,32.38 4.59,27.79 5.08,27.3 LED2.A
N$85
  Top 0.152: LED3.A 4.29,24.92 4.29,27.71 4.28,27.71 4.28,30.3 3.76,30.82 3.48,30.82 R11.1
N$86
  Top 0.152: U$9.6 8.13,22.34 6.83,23.65 3.02,23.65 2.86,23.81 LED3.C
N$87
  Top 0.152: LED1.C 3.49,29.69 3.89,29.29 3.89,26.31 3.76,26.18 1.89,26.18 1.75,26.04 1.75,24.02 2.41,23.35 3.49,23.35 4.33,22.52 U$8.6
N$88
  Top 0.152: U$8.3 2.38,19.53 2.86,20 2.86,22.23 1.27,23.81 1.27,26.51 2.06,27.3 LED2.C
V+
  Top 0.762: C14.1 C13.1 PIN1.11 PIN1.12
  Bottom 0.762: PIN1.11 19.05,52.7 16.68,50.33 16.68,41.69 17.43,40.93 17.49,40.93 U$1.9 U$1.8 U$1.7

### Text on the board
tPlace: Input | PRE / AMP | Output | 12V | 5V | -12V | C11 | - | + | Lucas Mun | - | Bat-Board Rev 2.2 / July 2018 | + | - | +